# EAGLE design battery_controller (EAGLE 6.4)
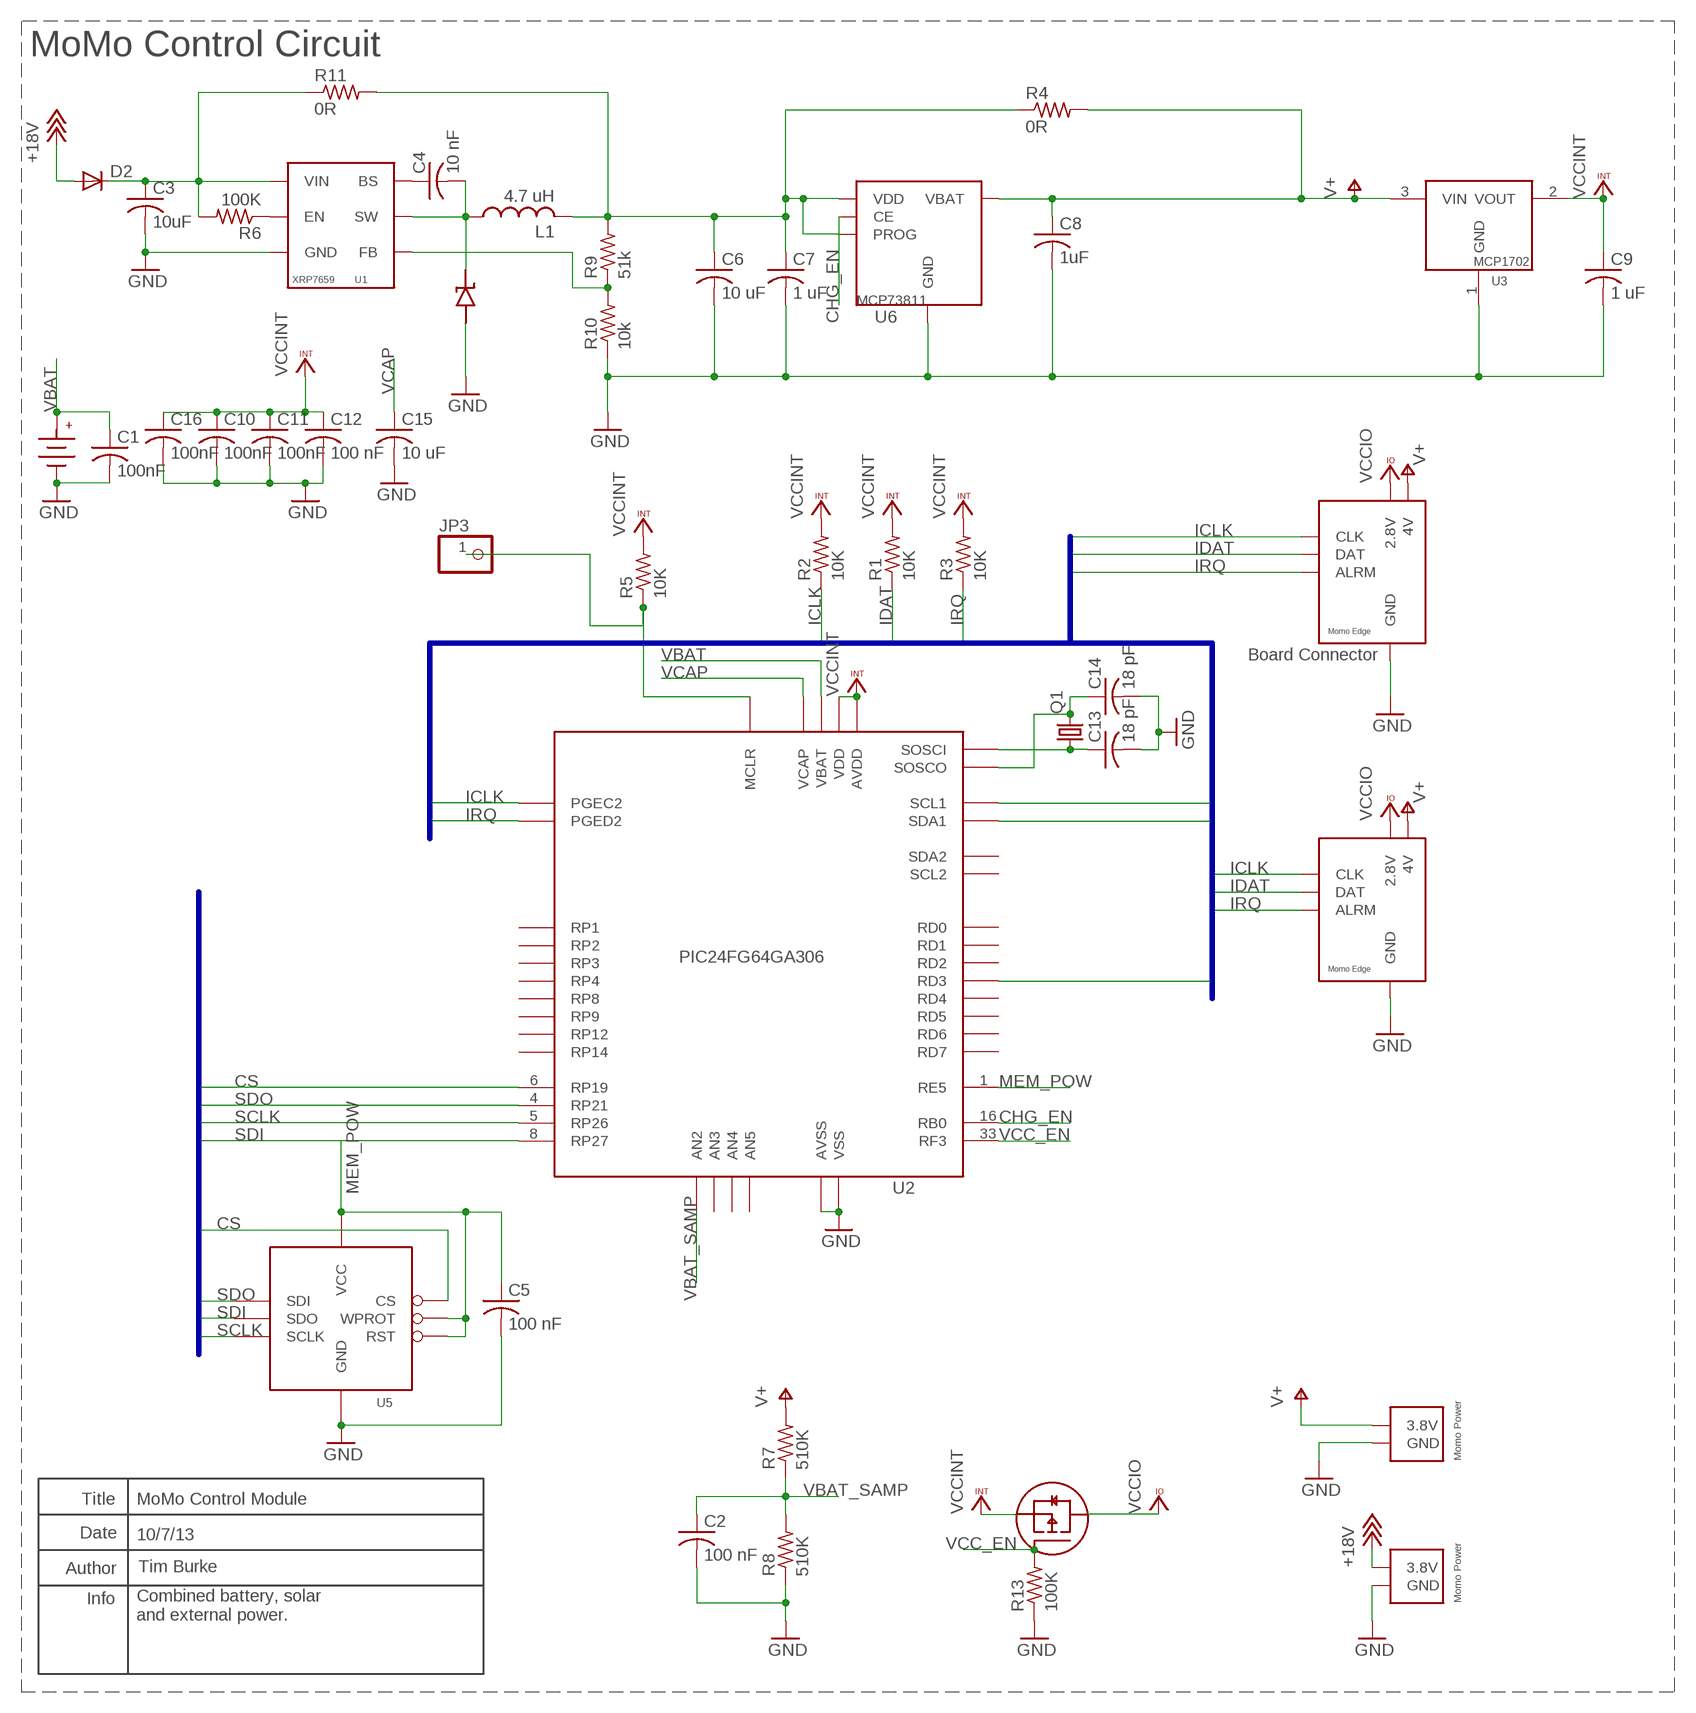
[diagram p0: schematic, sheet 1]

## Parts
BATT1  CR1025-HOLDER  [CR1025-HOLDER]
C1  100nF  C-USC0402  [C0402]
C2  100 nF  C-USC0402  [C0402]
C3  10uF  C-USC0805  [C0805]
C4  10 nF  C-USC0402  [C0402]
C5  100 nF  C-USC0402  [C0402]
C6  10 uF  C-USC0805  [C0805]
C7  1 uF  C-USC0402  [C0402]
C8  1uF  C-USC0402  [C0402]
C9  1 uF  C-USC0402  [C0402]
C10  100nF  C-USC0402  [C0402]
C11  100nF  C-USC0402  [C0402]
C12  100 nF  C-USC0402  [C0402]
C13  18 pF  C-USC0402K  [C0402K]
C14  18 pF  C-USC0402K  [C0402K]
C15  10 uF  C-USC0805  [C0805]
C16  100nF  C-USC0402  [C0402]
D1  DIODE_SS2P3SS2P3  [DIODE_SS2P3]
D2  DIODE-DO214AC  [DO214AC]
JP1  MOMO-VERT-6M  [1X06]
JP2  MOMO-EDGE-6F  [MOMO-EDGE-8F]
JP3  PINHD-1X1  [1X01]
JP4  MOMO-EDGE-POWER-M  [MOMO-EDGE-SMALL-2M]
JP5  MOMO-EDGE-POWER-M  [MOMO-EDGE-SMALL-2M]
L1  4.7 uH  NR6028-INDUCTOR  [NR6028-INDUCTOR]
Q1  CRYSTALTC26H  [TC26H]
Q2  P-MOSFET  [SOT23]
R1  10K  R-US_R0603  [R0603]
R2  10K  R-US_R0603  [R0603]
R3  10K  R-US_R0603  [R0603]
R4  0R  R-US_R0603  [R0603]
R5  10K  R-US_R0603  [R0603]
R6  100K  R-US_R0603  [R0603]
R7  510K  R-US_R0603  [R0603]
R8  510K  R-US_R0603  [R0603]
R9  51k  R-US_R0603  [R0603]
R10  10k  R-US_R0603  [R0603]
R11  0R  R-US_R0603  [R0603]
R13  100K  R-US_R0603  [R0603]
U1  XRP7659  [SOT23-6L]
U2  PIC24FJ64GA306  [TQFP64-10X10]
U3  MCP1702  [SOT23]
U5  FLASH8MSOP8  [SOP08]
U6  MCP73811  [SOT23-5L]

## Nets
+18V: D2.A JP5.2(3.8V)
BUCK_EN: R6.1 U1.4(EN)
CHG_EN: U2.16(RB0) U6.1(CE)
CS: U2.6(RP19) U5.1(CS)
GND: BATT1.-1(-) BATT1.-2(-) C1.2 C2.2 C3.2 C5.2 C6.2 C7.2 C8.2 C9.2 C10.2 C11.2 C12.2 C13.2 C14.2 C15.2 C16.2 D1.AN JP1.7(GND) JP2.GND JP4.1(GND) JP5.1(GND) R8.1 R10.1 R13.1 U1.2(GND) U2.9(VSS) U2.20(AVSS) U2.25(VSS) U2.41(VSS) U3.1(GND) U5.4(GND) U6.2(GND)
ICLK: JP1.3(CLK) JP2.CLK R2.1 U2.17(PGEC2) U2.37(SCL1)
IDAT: JP1.4(DAT) JP2.DAT R1.1 U2.36(SDA1)
IRQ: JP1.5(ALRM) JP2.ARLM(ALRM) R3.1 U2.18(PGED2) U2.51(RD3)
MEM_POW: C5.1 U2.1(RE5) U5.3(WPROT) U5.7(RST) U5.8(VCC)
N$1: C3.1 D2.C R6.2 R11.1 U1.5(VIN)
N$4: JP3.1 R5.1 U2.7(MCLR)
N$5: C6.1 C7.1 L1.2 R4.1 R9.2 R11.2 U6.4(VDD) U6.5(PROG)
N$6: C14.1 Q1.2 U2.48(SOSCO)
N$7: C13.1 Q1.1 U2.47(SOSCI)
N$10: R9.1 R10.2 U1.3(FB)
N$12: C4.1 U1.1(BS)
N$13: C4.2 D1.CATH L1.1 U1.6(SW)
SCLK: U2.5(RP26) U5.6(SCLK)
SDI: U2.8(RP27) U5.2(SDO)
SDO: U2.4(RP21) U5.5(SDI)
V+: C8.1 JP1.6(4V) JP2.V4(4V) JP4.2(3.8V) R4.2 R7.2 U3.3(VIN) U6.3(VBAT)
VBAT: BATT1.+ C1.1 U2.57(VBAT)
VBAT_SAMP: C2.1 R7.1 R8.2 U2.14(AN2)
VCAP: C15.1 U2.56(VCAP)
VCC_EN: Q2.1(GATE) R13.2 U2.33(RF3)
VCCINT: C9.1 C10.1 C11.1 C12.1 C16.1 Q2.2(SOURCE) R1.2 R2.2 R3.2 R5.2 U2.10(VDD) U2.19(AVDD) U2.26(VDD) U2.38(VDD) U3.2(VOUT)
VCCIO: JP1.1(2.8V) JP2.V28(2.8V) Q2.3(DRAIN)
Unconnected: U2.11(AN5) U2.12(AN4) U2.13(AN3) U2.15(RP1) U2.21(RP8) U2.22(RP9) U2.29(RP14) U2.31(SDA2) U2.32(SCL2) U2.42(RP2) U2.43(RP4) U2.44(RP3) U2.45(RP12) U2.46(RD0) U2.49(RD1) U2.50(RD2) U2.52(RD4) U2.53(RD5) U2.54(RD6) U2.55(RD7)

## Buses
SPI:CS,SDI,SDO,SCLK
SENSOR:ICLK,IDAT,IRQ

## Notes on the sheet
- MoMo Control Circuit
- Board Connector
- Title | MoMo Control Module
- Date | 10/7/13
- Author | Tim Burke
- Info
- Combined battery, solar 
  and external power.

## Library data of the parts
BATT1 = components:CR1025-HOLDER; DESCRIPTION: CR1025 Battery Holder; DIGIKEY-PN: BHX1-1025-SM-ND; FOOTPRINT: Custom SMD
C1 C2 C5 C10-C12 C16 = rcl:C-US: CAPACITOR, American symbol; DIGIKEY-PN: 445-1265-1-ND
C3 C6 = rcl:C-US: CAPACITOR, American symbol; DIGIKEY-PN-BATT: 587-2985-1-ND; DIGIKEY-PN-EXTPOWER: 587-2985-1-ND
C4 = rcl:C-US: CAPACITOR, American symbol; DIGIKEY-PN-BATT: 445-1260-1-ND; DIGIKEY-PN-EXTPOWER: 445-1260-1-ND
C7 C8 = rcl:C-US: CAPACITOR, American symbol; DIGIKEY-PN-BATT: 445-4114-1-ND; DIGIKEY-PN-SOLAR: 445-4114-1-ND
C9 = rcl:C-US: CAPACITOR, American symbol; DIGIKEY-PN: 445-4114-1-ND
C13 C14 = rcl:C-US: CAPACITOR, American symbol; DIGIKEY-PN: 445-1238-1-ND
C15 = rcl:C-US: CAPACITOR, American symbol; DIGIKEY-PN: 1276-1119-1-ND
D1 = components:DIODE_SS2P3; DIGIKEY-PN-BATT: SS2P3-M3/84AGICT-ND; DIGIKEY-PN-EXTPOWER: SS2P3-M3/84AGICT-ND
D2 = diode:DIODE-: DIODE; DESCRIPTION: Schottky Diode; DIGIKEY-PN: SL13HE3/61TGICT-ND
JP1 = components:MOMO-VERT-6M; DIGIKEY-PN: S1011EC-06-ND
JP2 = components:MOMO-EDGE-6F; DIGIKEY-PN: S5442-ND
JP3 = pinhead:PINHD-1X1: PIN HEADER
JP4 JP5 = components:MOMO-EDGE-POWER-M; DESCRIPTION: 2 pin R/A keyed male header; DIGIKEY-PN: A19450-ND
L1 = components:NR6028-INDUCTOR; DIGIKEY-PN-BATT: 587-2100-1-ND; DIGIKEY-PN-EXTPOWER: 587-2100-1-ND
Q1 = crystal:CRYSTAL: CRYSTAL; DIGIKEY-PN: 535-9034-ND; OC_FARNELL: unknown; OC_NEWARK: unknown
Q2 = components:P-MOSFET; DIGIKEY-PN: IRLML6401PBFCT-ND
R1-R3 R5 = rcl:R-US_: RESISTOR, American symbol; DIGIKEY-PN: P10.0KHCT-ND
R4 = rcl:R-US_: RESISTOR, American symbol; DIGIKEY-PN-EXTPOWER: P0.0GCT-ND
R6 = rcl:R-US_: RESISTOR, American symbol; DIGIKEY-PN-BATT: P100KHCT-ND; DIGIKEY-PN-EXTPOWER: P100KHCT-ND
R7 R8 = rcl:R-US_: RESISTOR, American symbol; DIGIKEY-PN: P510KHCT-ND
R9 = rcl:R-US_: RESISTOR, American symbol; DIGIKEY-PN-BATT: P51.0KHCT-ND; DIGIKEY-PN-EXTPOWER: P51.0KHCT-ND
R10 = rcl:R-US_: RESISTOR, American symbol; DIGIKEY-PN-BATT: P10.0KHCT-ND; DIGIKEY-PN-EXTPOWER: P13.0KHCT-ND
R11 = rcl:R-US_: RESISTOR, American symbol; DIGIKEY-PN-SOLAR: P0.0GCT-ND
R13 = rcl:R-US_: RESISTOR, American symbol; DIGIKEY-PN: P100KHCT-ND
U1 = components:XRP7659; DIGIKEY-PN-BATT: 1016-1751-1-ND; DIGIKEY-PN-EXTPOWER: 1016-1751-1-ND
U2 = components:PIC24FJ64GA306; DESCRIPTION: PIC24FJ64GA306 Microcontroller; DIGIKEY-PN: PIC24FJ64GA306-I/PT-ND; FOOTPRINT: TQFN64-10mm
U3 = components:MCP1702; DIGIKEY-PN: MCP1702T-2802E/CBCT-ND
U5 = components:FLASH8M; DIGIKEY-PN: M25PX80-VMN6TPCT-ND
U6 = components:MCP73811; DIGIKEY-PN-BATT: MCP73811T-420I/OTCT-ND; DIGIKEY-PN-SOLAR: MCP73811T-420I/OTCT-ND

## Net classes
0 default: width 0.152 mm, drill 0.305 mm, clearance 0.152 mm

## Board
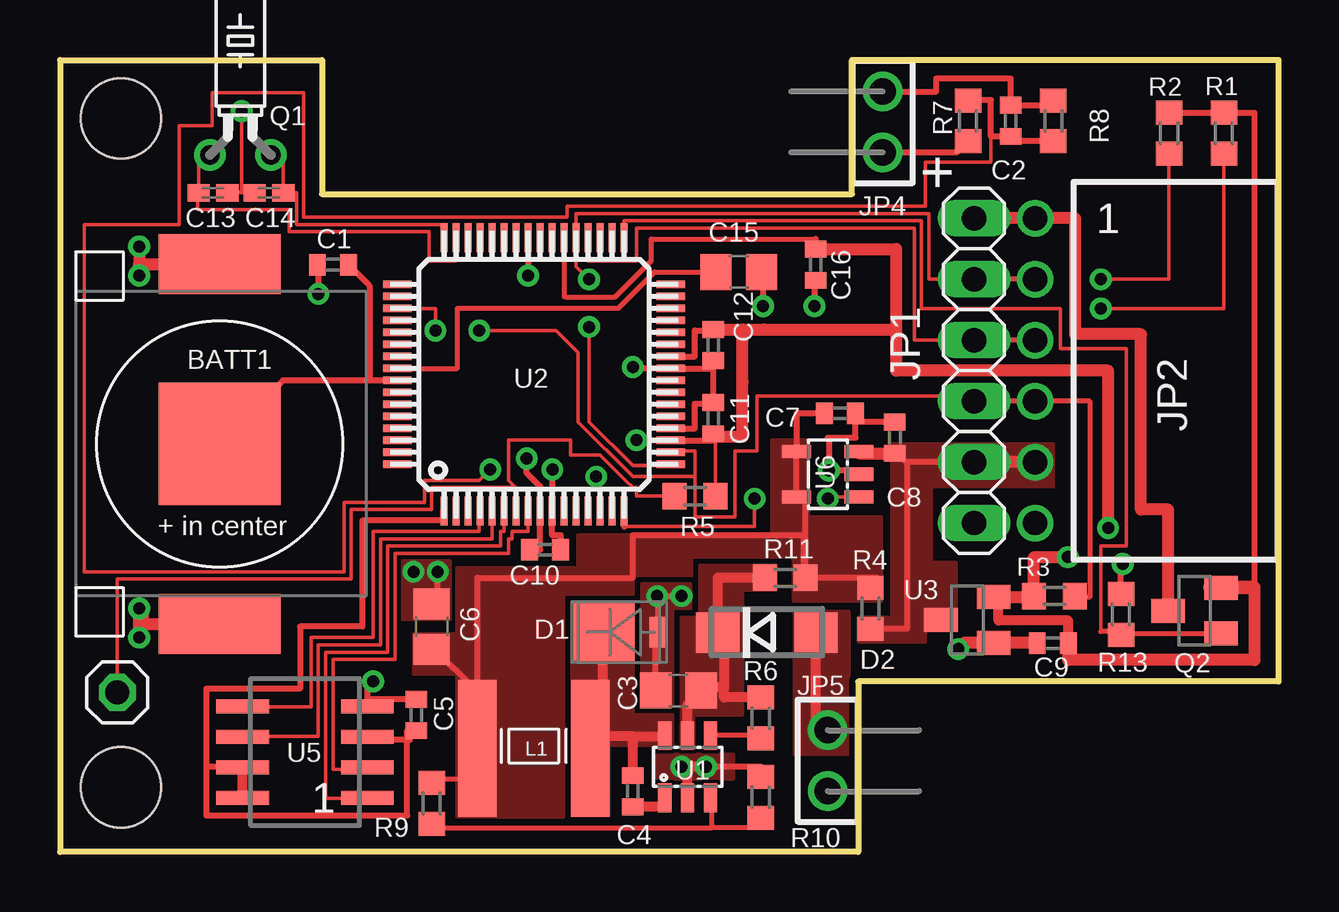
[diagram p1: board, top side]
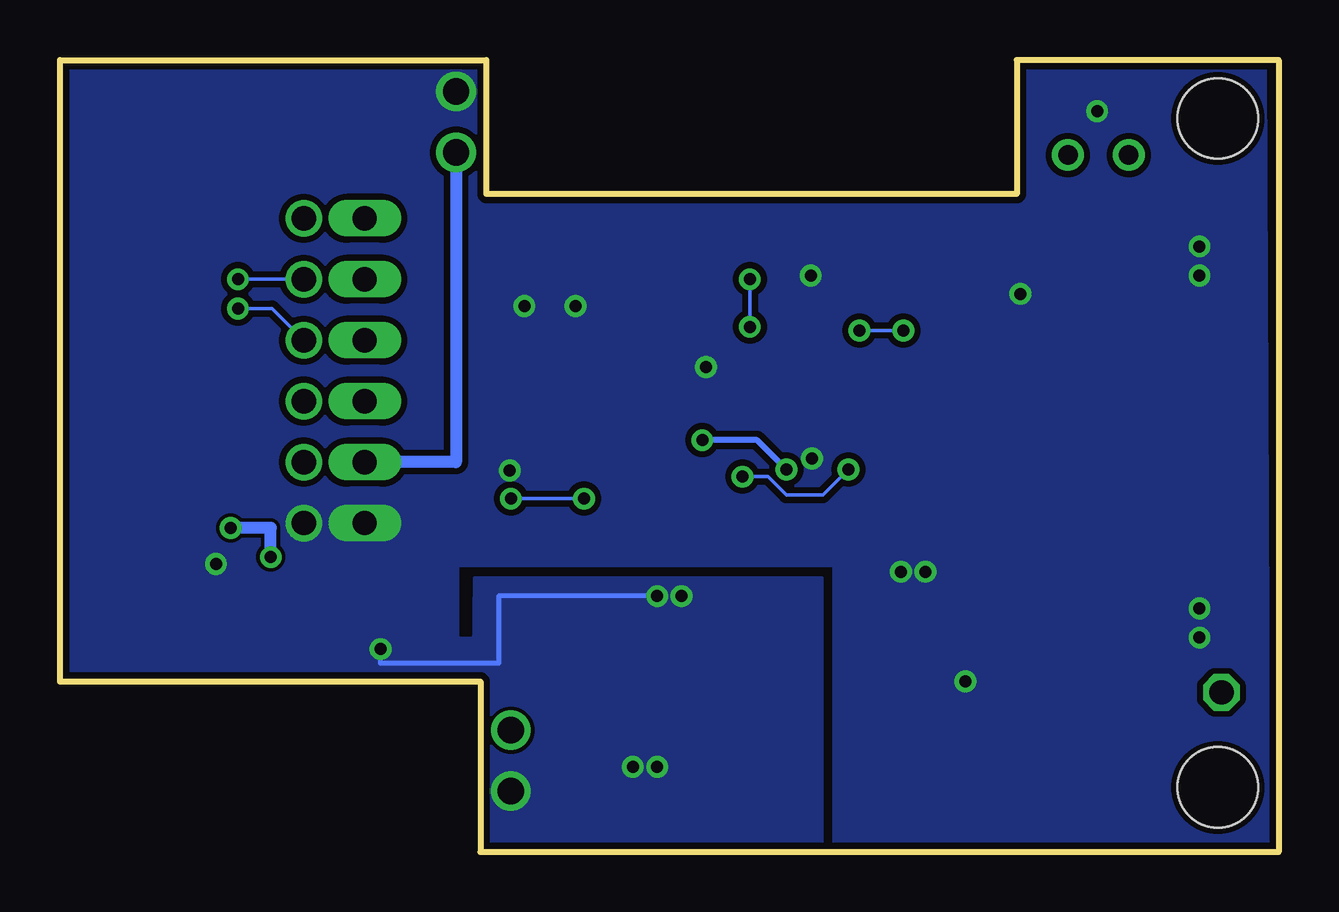
[diagram p2: board, bottom side, seen from below]

Size 50.8 x 33.02 mm. Coordinates in mm from the lower left corner, seen from the top.
Outline: 50.8,7.11 50.8,33.02 33.02,33.02 33.02,27.43 10.92,27.43 10.92,33.02 0,33.02 0,0 33.27,0 33.27,7.11 50.8,7.11
Copper layers (1*16): Top 0.035mm / dielectric 1.5mm / Bottom 0.035mm
Design rules "default *": minimum track width 6mil, minimum drill 19mil, track to track 6mil, track to pad 6mil, pad to pad 6mil, via to via 6mil, smd to smd 6mil, copper to edge 10mil, drill to drill 8mil, minimum pad ring 10mil, minimum via ring 8mil, stop-mask expansion 4mil, vias tented up to drill 0mil, thermal gap 10mil
Holes 3.35 mm at 2.54,2.69 2.54,30.58

### Footprints (pad centres in the part's own frame; a part is rotated, then mirrored left to right if it is on the bottom)
CR1025-HOLDER = smd 5.1 x 5.1: + 0,0 | smd 2.5 x 5.1: -1 7.5,0; -2 -7.5,0
C0402 = smd 0.7 x 0.9: 1 -0.65,0; 2 0.65,0
C0805 = smd 1.3 x 1.5: 1 -0.95,0; 2 0.95,0
C0402K = smd 0.925 x 0.74: 1 -0.6,0; 2 0.6,0
DIODE_SS2P3 = smd 0.762 x 1.27: AN 2.349,0 | smd 2.667 x 2.54: CATH 0,0
DO214AC = smd 1.8 x 1.7: A 2.05,0; C -2.05,0
1X06 = drill 1.016 long: 1 -8.89,0; 3 -6.35,0; 4 -3.81,0; 5 -1.27,0; 6 1.27,0; 7 3.81,0
MOMO-EDGE-8F = drill 1.016: ARLM 0,2.54; CLK 0,7.62; DAT 0,5.08; GND 0,-2.54; V4 0,0; V28 0,10.16
1X01 = drill 1.016 octagon: 1 0,0
MOMO-EDGE-SMALL-2M = drill 1.1: 1 1.27,0; 2 -1.27,0
NR6028-INDUCTOR = smd 1.6 x 5.7: 1 0,0; 2 4.7,0
TC26H = drill 0.813: 1 -1.27,0; 2 1.27,0
SOT23 = smd 1 x 1.4: 1 -0.95,-1.1; 2 0.95,-1.1; 3 0,1.1
R0603 = smd 1 x 1.1: 1 -0.85,0; 2 0.85,0
SOT23-6L = smd 0.55 x 1.2: 1 -0.95,-1.3; 2 0,-1.3; 3 0.95,-1.3; 4 0.95,1.3; 5 0,1.3; 6 -0.95,1.3
TQFP64-10X10 = smd 1.2 x 0.3: 1 -5.7,3.75; 2 -5.7,3.25; 3 -5.7,2.75; 4 -5.7,2.25; 5 -5.7,1.75; 6 -5.7,1.25; 7 -5.7,0.75; 8 -5.7,0.25; 9 -5.7,-0.25; 10 -5.7,-0.75; 11 -5.7,-1.25; 12 -5.7,-1.75; 13 -5.7,-2.25; 14 -5.7,-2.75; 15 -5.7,-3.25; 16 -5.7,-3.75; 33 5.7,-3.75; 34 5.7,-3.25; 35 5.7,-2.75; 36 5.7,-2.25; 37 5.7,-1.75; 38 5.7,-1.25; 39 5.7,-0.75; 40 5.7,-0.25; 41 5.7,0.25; 42 5.7,0.75; 43 5.7,1.25; 44 5.7,1.75; 45 5.7,2.25; 46 5.7,2.75; 47 5.7,3.25; 48 5.7,3.75 | smd 0.3 x 1.2: 17 -3.75,-5.7; 18 -3.25,-5.7; 19 -2.75,-5.7; 20 -2.25,-5.7; 21 -1.75,-5.7; 22 -1.25,-5.7; 23 -0.75,-5.7; 24 -0.25,-5.7; 25 0.25,-5.7; 26 0.75,-5.7; 27 1.25,-5.7; 28 1.75,-5.7; 29 2.25,-5.7; 30 2.75,-5.7; 31 3.25,-5.7; 32 3.75,-5.7; 49 3.75,5.7; 50 3.25,5.7; 51 2.75,5.7; 52 2.25,5.7; 53 1.75,5.7; 54 1.25,5.7; 55 0.75,5.7; 56 0.25,5.7; 57 -0.25,5.7; 58 -0.75,5.7; 59 -1.25,5.7; 60 -1.75,5.7; 61 -2.25,5.7; 62 -2.75,5.7; 63 -3.25,5.7; 64 -3.75,5.7
SOP08 = smd 0.6 x 2.2: 1 -1.905,-2.6; 2 -0.635,-2.6; 3 0.635,-2.6; 4 1.905,-2.6; 5 1.905,2.6; 6 0.635,2.6; 7 -0.635,2.6; 8 -1.905,2.6
SOT23-5L = smd 0.55 x 1.2: 1 -0.95,-1.3; 2 0,-1.3; 3 0.95,-1.3; 4 0.95,1.3; 5 -0.95,1.3

### Placement (x,y rotation side)
BATT1  6.65,17.02 270 top
C1  11.38,24.49 180 top
C2  39.62,30.48 90 top
C3  25.78,6.73 180 top
C4  23.88,2.54 90 top
C5  14.86,5.71 90 top
C6  15.49,9.4 90 top
C7  32.51,18.29 0 top
C8  34.8,17.27 90 top
C9  41.38,8.71 180 top
C10  20.22,12.6 180 top
C11  27.23,18.08 90 top
C12  27.23,21.13 270 top
C13  6.38,27.48 0 top
C14  8.71,27.48 180 top
C15  28.3,24.18 0 top
C16  31.5,24.49 270 top
D1  22.61,9.17 0 top
D2  29.46,9.14 0 top
JP1  38.1,17.53 270 top
JP2  40.64,16.26 0 top
JP3  2.39,6.65 0 top
JP4  34.29,30.43 90 top
JP5  32,3.81 270 top
L1  22.1,4.32 180 top
Q1  7.52,29.06 0 top
Q2  47.29,10.06 90 top
R1  48.51,29.97 90 top
R2  46.23,29.97 90 top
R3  41.45,10.67 180 top
R4  33.78,10.16 270 top
R5  26.47,14.83 0 top
R6  29.21,5.59 90 top
R7  37.85,30.48 270 top
R8  41.4,30.48 270 top
R9  15.49,2.03 90 top
R10  29.21,2.29 270 top
R11  30.23,11.43 0 top
R13  44.22,9.91 270 top
U1  26.16,3.56 0 top
U2  19.76,19.91 90 top
U3  37.82,9.68 90 top
U5  10.21,4.17 90 top
U6  32,15.75 90 top

### Tracks (layer width: path | path; a pad name or v marks a point on that pad's centre or on a via)
+18V
  Top 0.406: JP5.2 31.51,5.08 D2.A
  pour Top (no thermals): 30.61,10.03 30.61,4.06 32.89,4.06 32.89,10.03
BUCK_EN
  Top 0.203: R6.1 29.21,4.86 U1.4
CHG_EN  (via drill 0.5)
  Top 0.152: 33.27,14.8 32,14.8 v32,14.73 | v28.96,14.73 28.96,13.56 23.51,13.56
  Top 0.254: U6.1 33.27,14.8 | 23.51,13.56 U2.16
  Bottom 0.152: v32,14.73 v28.96,14.73
CS
  Top 0.152: U5.1 12.81,2.23 11.07,2.23 11.07,8.33 13.66,8.33 13.66,12.75 18.36,12.75 18.36,13.36 18.39,13.36 18.51,13.36 U2.6
GND  (via drill 0.5)
  Top 0.152: C14.2 C13.2 6.98,27.53 7.57,27.53 v7.57,30.89
  Top 0.254: R13.1 44.22,12.01 v44.3,12.01 | 34.8,17.8 C8.2 33.16,17.92 C7.2 33.16,17.27 32,17.27 arc-90 32.05,17.22 v32.05,15.9 33.15,15.9 arc-90 U6.2 | R10.1 29.21,3.56 v26.92,3.56 | C3.2 24.83,9.17 D1.AN 24.96,10.67 v24.89,10.67 v25.91,10.67 | C5.2 12.81,6.37 U5.4 12.81,7.11 v13.06,7.11 | C12.2 27.23,20.16 U2.25 23.88,20.16 v23.88,20.22 | C12.2 C11.2 27.23,18.69 26.47,18.69 26.47,17.66 U2.20 | JP4.1 36.53,31.7 36.53,32.26 39.62,32.26 C2.2 41.4,31.13 R8.1 | C12.2 | U2.41 v19.51,24.03 | v19.46,16.41 19.46,15.8 20.01,15.24 U2.9 20.01,12.6 C10.2 | C15.2 29.31,24.18 v29.31,22.76 | C16.2 31.44,23.84 v31.44,22.76 | C1.2 10.77,24.45 v10.77,23.27 | C6.2 15.75,10.6 v15.75,11.68
  Top 0.406: U1.2 26.16,3.3 v25.91,3.56 v26.92,3.56
  Top 0.508: C9.2 38.94,8.71 U3.1 37.71,8.73 v37.44,8.46 | 6.66,25.25 BATT1.-2 3.3,24.52 v3.3,24.03 v3.3,25.25 | v3.3,8.94 v3.3,10.16 3.45,10.16 3.45,9.52 BATT1.-1
  Bottom 0.203: v25.91,10.67 32.51,10.67 32.51,7.87 37.44,7.87 v37.44,8.46
  other vias: 14.73,11.68
  pour Bottom (no thermals): 33.53,11.43 19.05,11.43 19.05,0.25 33.66,0.3
  pour Bottom (isolate 0.254, rank 2, no thermals): 0.41,0.25 18.54,0.25 18.54,11.94 51,11.94 50.7,32.87 0.56,32.87
  pour Bottom (no thermals): 34.29,7.11 50.8,7.11 50.8,14.22 34.29,14.22
  pour Bottom (no thermals): 32.77,8.89 32.77,7.37 35.81,7.37 35.81,8.89
  pour Top (no thermals): 25.53,6.1 25.53,10.16 26.29,10.16 26.29,11.18 24.26,11.18 24.26,6.1
  pour Top (no thermals): 24.89,4.06 24.89,3.05 28.07,3.05 28.07,4.06
  pour Top (no thermals): 16.26,9.7 16.26,12.14 14.27,12.14 14.27,9.7
ICLK  (via drill 0.5)
  Top 0.152: JP1.3 36.22,23.88 36.22,26.62 21.51,26.62 U2.37 21.51,24.41 v22.05,23.88 | R2.1 46.23,23.88 v43.38,23.88 | v22.05,21.89 22.05,17.93 23.88,16.1 25.4,16.1 U2.17
  Top 0.203: JP2.CLK JP1.3
  Bottom 0.152: v43.38,23.88 JP2.CLK | v22.05,23.88 v22.05,21.89
IDAT  (via drill 0.5)
  Top 0.152: 22.05,25.61 U2.36 22.01,24.64 24.03,24.64 24.03,26.01 35.61,26.01 35.61,21.34 JP1.4 | R1.1 48.51,22.66 v43.38,22.66
  Top 0.203: JP2.DAT JP1.4
  Bottom 0.152: v43.38,22.66 41.96,22.66 JP2.DAT
IRQ  (via drill 0.5)
  Top 0.152: U2.18 25.46,16.71 26.47,16.71 26.47,15.65 | JP1.5 38.1,19 29.06,19 29.06,16.71 28.14,16.71 28.14,13.97 26.47,13.97 26.47,15.65 | U2.51 15.65,22.66 v15.65,21.74 | v17.48,21.74 20.68,21.74 21.59,20.83 21.59,17.93 23.88,15.65 26.47,15.65
  Top 0.203: JP1.5 JP2.ARLM 42.93,18.8 42.93,10.62 42.3,10.62 R3.1
  Bottom 0.152: v15.65,21.74 v17.48,21.74
MEM_POW
  Top 0.203: U5.7 7.61,3.56 | 6.1,3.56 6.1,3.45 | 14.48,5.06 C5.1
  Top 0.254: 7.61,3.56 6.1,3.56 | U2.1 15.95,14.21 15.95,13.82 12.6,13.82 12.6,9.4 10.01,9.4 10.01,6.81 6.1,6.81 6.1,3.45 6.1,1.52 14.48,1.52 14.48,5.06 14.58,5.06 14.58,4.67 12.81,4.67 U5.3
  Top 0.406: U5.8 U5.7
N$1
  Top 0.406: R6.2 27.69,6.44 27.69,6.86 | 27.69,6.86 26.73,6.86 C3.1 26.16,6.16 U1.5 | 27.69,6.86 27.69,9.14 D2.C 27.41,11.43 R11.1
  pour Top (no thermals): 25.91,4.44 26.42,4.44 26.42,5.71 28.45,5.71 28.45,10.16 26.67,10.16 26.67,9.78 25.91,9.78
  pour Top (no thermals): 28.45,8.38 28.45,10.92 29.84,10.92 29.84,11.94 26.67,11.94 26.67,8.38
N$4
  Top 0.152: JP3.1 2.39,11.38 12.14,11.38 12.14,14.28 15.49,14.28 15.49,15.19 19.01,15.19 19.01,15.18 | R5.1 24.03,14.83 24.03,15.19 23.88,15.19 23.57,15.49 22.5,16.56 21.28,16.56 21.28,17.17 18.71,17.17 18.69,17.16 18.69,15.49 19.01,15.18 | 19.01,15.18 U2.7
N$5
  Top 0.203: R9.2 15.24,3.05 17.27,3.05 17.27,4.32 L1.2
  Top 0.254: 17.27,4.32 17.27,6.79 15.62,8.45 C6.1 | L1.2 17.4,11.43 23.88,11.43 23.88,13.21 30.99,13.21 30.99,11.43 R11.2 | R11.2 31.08,14.8 U6.5 U6.4 30.7,18.29 C7.1 | R4.1 34.04,11.43 R11.2
  pour Top (no thermals): 16.56,1.47 20.98,1.47 20.98,10.77 23.88,10.77 23.88,11.53 26.31,11.53 26.31,12.29 30.58,12.29 30.58,10.46 34.24,10.46 34.24,13.97 31.19,13.97 31.19,17.17 29.67,17.17 29.67,13.21 21.59,13.21 21.59,11.84 16.56,11.84
  pour Top (no thermals): 14.73,9.09 17.32,9.09 17.32,7.42 14.73,7.42
N$6
  Top 0.152: U2.48 16.01,26.16 9.85,26.16 9.85,27.48 C14.1 | 9.25,27.48 C14.1 | C14.1 9.31,29.06 Q1.2
N$7
  Top 0.152: U2.47 16.51,24.64 15.39,24.64 15.39,25.86 9.55,25.86 9.55,26.77 5.74,26.77 5.74,27.48 C13.1 5.77,29.06 Q1.1
N$10
  Top 0.203: 27.18,1.02 27.18,2.26 U1.3 | R10.2 29.21,1.02 27.18,1.02 | 15.24,1.02 15.49,1.02 | 15.49,1.02 27.18,1.02 | R9.1 15.49,1.02
N$12
  Top 0.406: U1.1 25.21,1.89 C4.1
N$13
  Top 0.406: D1.CATH 22.61,4.83 | 22.61,4.83 L1.1 | 23.88,4.83 25.18,4.83 U1.6 | C4.2 23.88,4.83 | 23.88,4.83 22.61,4.83
  pour Top (no thermals): 25.53,4.44 25.53,5.71 23.88,5.71 23.88,10.41 21.34,10.41 21.34,1.52 22.86,1.52 22.86,4.44
SCLK
  Top 0.152: U2.5 18.01,13.06 13.36,13.06 13.36,8.64 10.77,8.64 10.77,4.83 7.61,4.83 U5.6
SDI
  Top 0.152: U5.2 12.81,3.45 11.38,3.45 11.38,8.03 13.97,8.03 13.97,12.45 18.6,12.45 18.69,12.45 18.69,13.06 18.85,13.06 18.85,13.36 19.51,13.36 U2.8
SDO
  Top 0.152: U2.4 17.48,14.21 17.48,13.36 13.06,13.36 13.06,8.94 10.46,8.94 10.46,6.04 7.61,6.04 U5.5
V+
  Top 0.254: U6.3 33.3,16.62 | C8.1 35.31,16.26 | U3.3 36.72,9.82 | R4.2 35.31,9.31 35.31,16.26 | JP1.6 35.31,16.26 | R7.2 37.38,29.16 JP4.2
  Top 0.508: 33.3,16.62 C8.1 | JP2.V4 JP1.6
  Bottom 0.508: JP4.2 34.29,16.26 JP1.6
  pour Top (no thermals): 33.27,9.78 33.27,8.76 36.07,8.76 36.07,8.89 36.07,9.14 36.07,9.27 37.34,9.27 37.34,12.06 36.32,12.06 36.32,15.24 41.4,15.24 41.4,17.02 34.67,17.02 34.67,9.78
VBAT
  Top 0.254: U2.57 12.9,19.66 | 12.9,19.66 9.3,19.66 BATT1.+ | C1.1 12.9,23.61 12.9,19.66
VBAT_SAMP  (via drill 0.5)
  Top 0.152: 38.81,29.83 38.81,28.75 36.07,28.75 36.07,26.92 21.13,26.92 21.13,26.47 10.16,26.47 10.16,31.65 6.35,31.65 6.35,30.28 4.98,30.28 4.98,26.16 1.02,26.16 1.02,11.68 11.84,11.68 11.84,14.58 15.19,14.58 15.19,15.49 17.48,15.49 v17.93,15.95 | U2.14 22.51,15.65 v22.35,15.65
  Top 0.254: R8.2 39.62,29.63 C2.1 38.81,29.83 38.81,31.34 37.85,31.34 R7.1
  Bottom 0.152: v22.35,15.65 21.28,15.65 20.52,14.88 19,14.88 v17.93,15.95
VCAP
  Top 0.203: U2.56 16.56,20.16 16.56,22.66 23.27,22.66 24.79,24.18 C15.1
VCC_EN
  Top 0.152: 43.38,9.19 43.38,12.75 44.45,12.75 44.45,20.98 41.71,20.98 41.71,22.66 35.92,22.66 35.92,26.31 23.51,26.31 U2.33
  Top 0.203: R13.2 44.22,9.11 | 44.22,9.11 Q2.1 | 44.22,9.11 44.22,9.19 43.38,9.19
VCCINT  (via drill 0.5)
  Top 0.152: 27.23,17.16 27.32,17.16 R5.2
  Top 0.203: U2.38 21.01,23.14 21.13,23.11 23.11,23.11 24.64,24.64 24.64,25.55 31.5,25.55
  Top 0.254: R2.2 R1.2 49.78,30.82 49.78,11.05 | 25.46,20.68 U2.26 26.47,20.66 26.47,21.74 27.23,21.74 C12.1 | 27.23,17.32 C11.1 27.23,17.16 U2.19 v24.03,17.17 | C10.1 20.87,13.21 20.51,13.21 U2.10 v20.52,15.95 | 31.5,25.55 C16.1
  Top 0.406: C9.1 42.03,9.65 39.12,9.65 39.12,10.63
  Top 0.508: 49.78,11.05 47.89,11.05 Q2.2 49.78,11.01 49.78,8 42.03,8 C9.1 | 38.92,10.48 U3.2 39.12,10.63 40.56,10.63 R3.2 40.6,12.29 v42.01,12.29 | v43.69,13.51 43.69,20.07 34.85,20.07 34.85,21.78 | 27.23,17.32 28.45,17.32 28.45,19.61 28.45,21.78 | C16.1 34.85,25.14 34.85,21.78 | C12.1 28.45,21.78 | 28.45,21.78 29.36,21.78 34.85,21.78
  Bottom 0.254: v20.52,15.95 21.74,17.17 v24.03,17.17
  Bottom 0.508: v42.01,12.29 42.01,13.51 v43.69,13.51
VCCIO
  Top 0.508: Q2.3 46.19,14.28 45.06,14.28 45.06,21.59 42.32,21.59 42.32,26.42 JP2.V28 JP1.1

### Text on the board
tPlace: + | + in center